# EAGLE schematic iRob_Upsized_F3DISCO_Shield v16 (EAGLE 9.7.0)
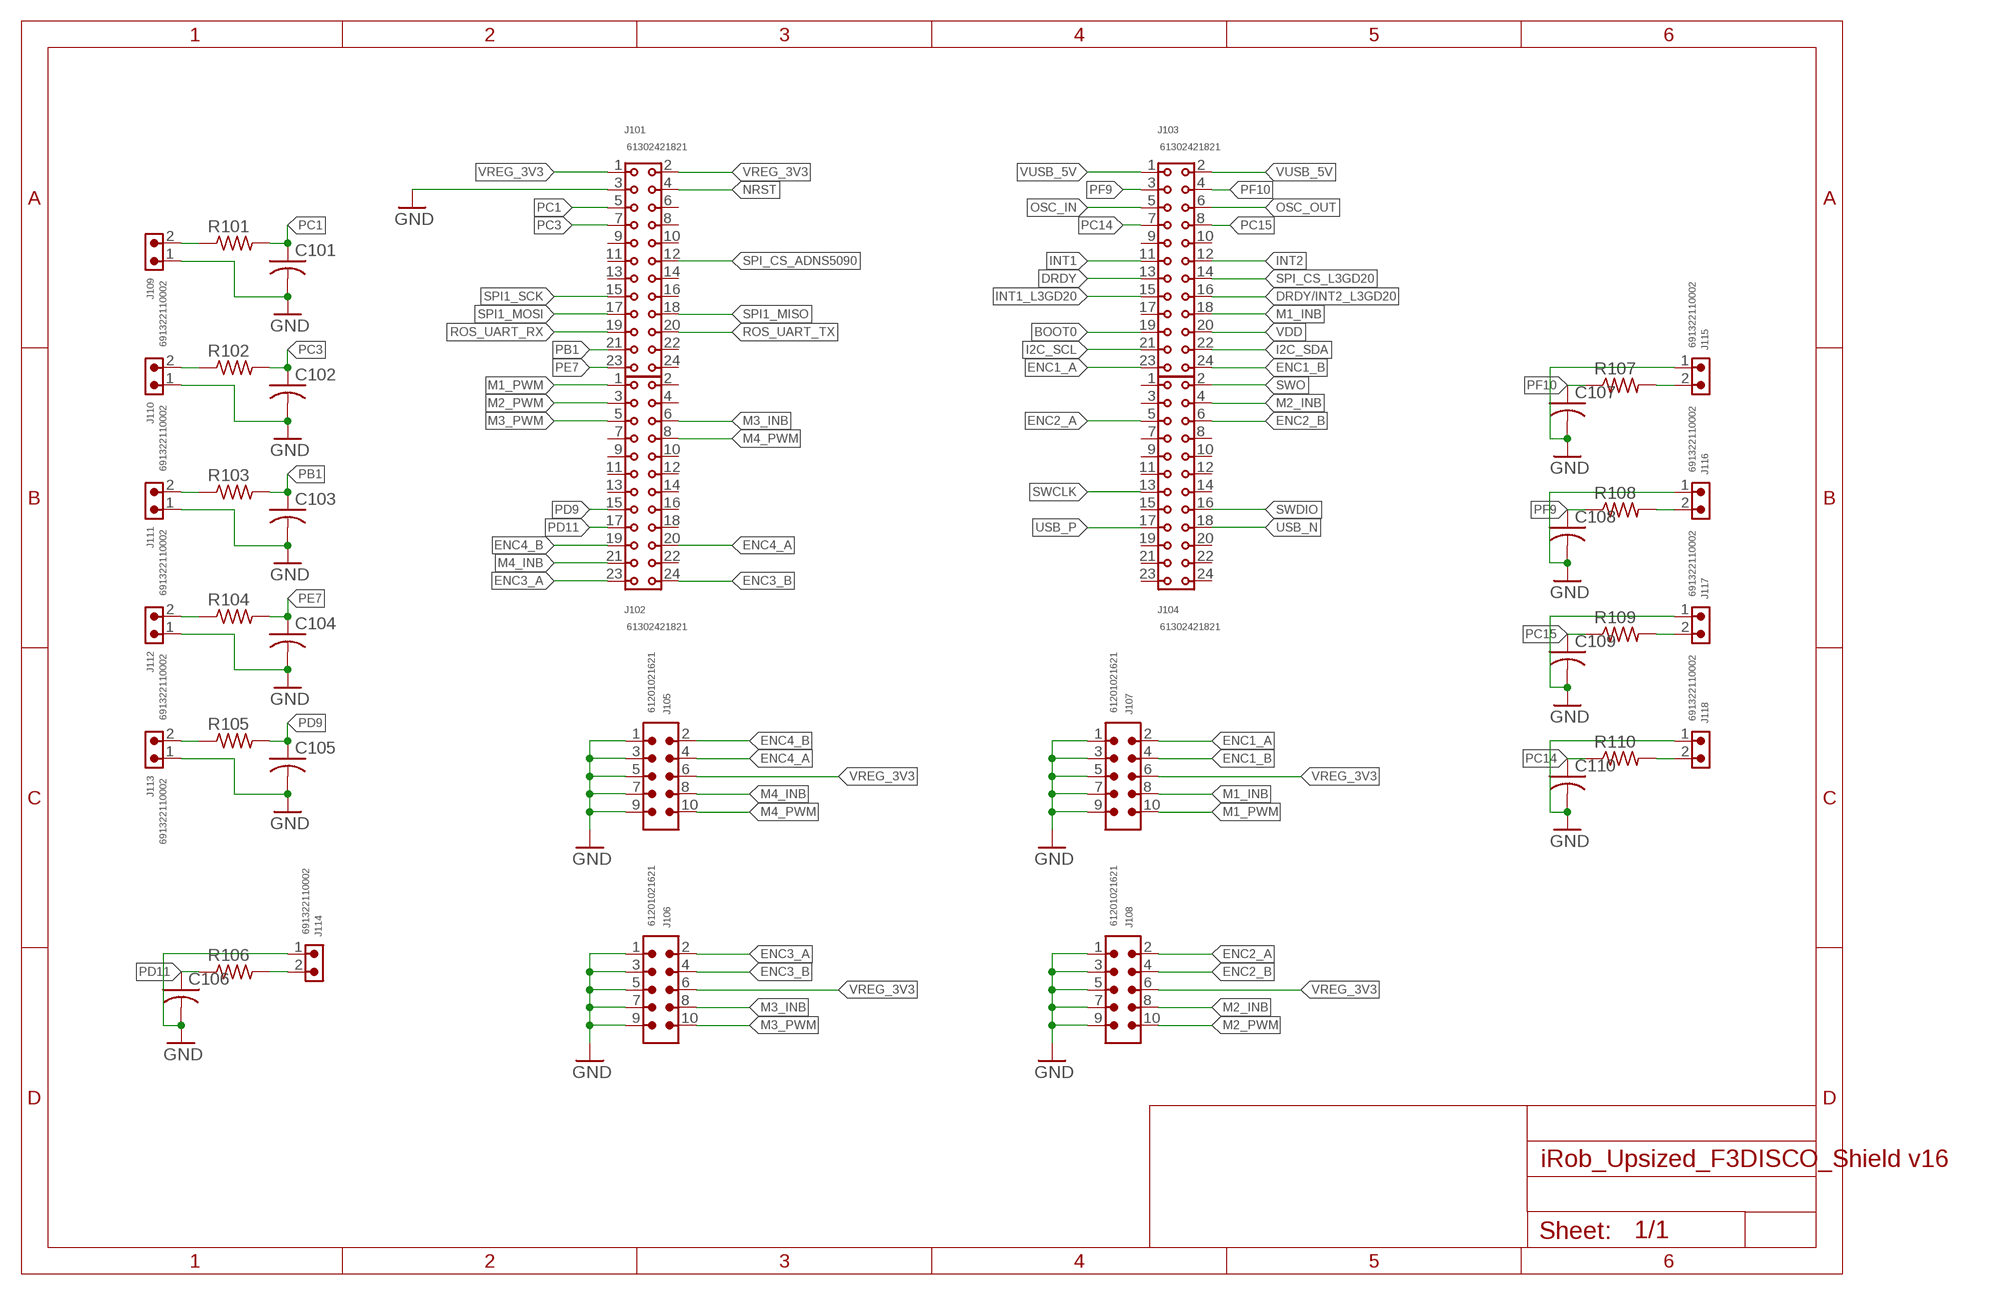
[diagram p0: schematic, sheet 1]

## Parts
C101  C-USC0603  [C0603]
C102  C-USC0603  [C0603]
C103  C-USC0603  [C0603]
C104  C-USC0603  [C0603]
C105  C-USC0603  [C0603]
C106  C-USC0603  [C0603]
C107  C-USC0603  [C0603]
C108  C-USC0603  [C0603]
C109  C-USC0603  [C0603]
C110  C-USC0603  [C0603]
J101  61302421821  6130XX21821_61302421821  [61302421821]
J102  61302421821  6130XX21821_61302421821  [61302421821]
J103  61302421821  6130XX21821_61302421821  [61302421821]
J104  61302421821  6130XX21821_61302421821  [61302421821]
J105  61201021621  6120XX21621_61201021621  [61201021621]
J106  61201021621  6120XX21621_61201021621  [61201021621]
J107  61201021621  6120XX21621_61201021621  [61201021621]
J108  61201021621  6120XX21621_61201021621  [61201021621]
J109  691322110002  691322110002  [691322110002]
J110  691322110002  691322110002  [691322110002]
J111  691322110002  691322110002  [691322110002]
J112  691322110002  691322110002  [691322110002]
J113  691322110002  691322110002  [691322110002]
J114  691322110002  691322110002  [691322110002]
J115  691322110002  691322110002  [691322110002]
J116  691322110002  691322110002  [691322110002]
J117  691322110002  691322110002  [691322110002]
J118  691322110002  691322110002  [691322110002]
R101  R-US_R0603  [R0603]
R102  R-US_R0603  [R0603]
R103  R-US_R0603  [R0603]
R104  R-US_R0603  [R0603]
R105  R-US_R0603  [R0603]
R106  R-US_R0603  [R0603]
R107  R-US_R0603  [R0603]
R108  R-US_R0603  [R0603]
R109  R-US_R0603  [R0603]
R110  R-US_R0603  [R0603]

## Nets
BOOT0: J103.19
DRDY: J103.13
DRDY/INT2_L3GD20: J103.16
ENC1_A: J103.23 J107.2
ENC1_B: J103.24 J107.4
ENC2_A: J104.5 J108.2
ENC2_B: J104.6 J108.4
ENC3_A: J102.23 J106.2
ENC3_B: J102.24 J106.4
ENC4_A: J102.20 J105.4
ENC4_B: J102.19 J105.2
GND: C101.2 C102.2 C103.2 C104.2 C105.2 C106.2 C107.2 C108.2 C109.2 C110.2 J101.3 J105.1 J105.3 J105.5 J105.7 J105.9 J106.1 J106.3 J106.5 J106.7 J106.9 J107.1 J107.3 J107.5 J107.7 J107.9 J108.1 J108.3 J108.5 J108.7 J108.9 J109.1 J110.1 J111.1 J112.1 J113.1 J114.1 J115.1 J116.1 J117.1 J118.1
I2C_SCL: J103.21
I2C_SDA: J103.22
INT1: J103.11
INT1_L3GD20: J103.15
INT2: J103.12
M1_INB: J103.18 J107.8
M1_PWM: J102.1 J107.10
M2_INB: J104.4 J108.8
M2_PWM: J102.3 J108.10
M3_INB: J102.6 J106.8
M3_PWM: J102.5 J106.10
M4_INB: J102.21 J105.8
M4_PWM: J102.8 J105.10
N$1: J109.2 R101.1
N$4: J110.2 R102.1
N$7: J111.2 R103.1
N$10: J112.2 R104.1
N$13: J113.2 R105.1
N$16: J114.2 R106.2
N$19: J115.2 R107.2
N$21: J116.2 R108.2
N$23: J117.2 R109.2
N$25: J118.2 R110.2
NRST: J101.4
OSC_IN: J103.5
OSC_OUT: J103.6
PB1: C103.1 J101.21 R103.2
PC1: C101.1 J101.5 R101.2
PC3: C102.1 J101.7 R102.2
PC14: C110.1 J103.7 R110.1
PC15: C109.1 J103.8 R109.1
PD9: C105.1 J102.15 R105.2
PD11: C106.1 J102.17 R106.1
PE7: C104.1 J101.23 R104.2
PF9: C108.1 J103.3 R108.1
PF10: C107.1 J103.4 R107.1
ROS_UART_RX: J101.19
ROS_UART_TX: J101.20
SPI1_MISO: J101.18
SPI1_MOSI: J101.17
SPI1_SCK: J101.15
SPI_CS_ADNS5090: J101.12
SPI_CS_L3GD20: J103.14
SWCLK: J104.13
SWDIO: J104.16
SWO: J104.2
USB_N: J104.18
USB_P: J104.17
VDD: J103.20
VREG_3V3: J101.1 J101.2 J105.6 J106.6 J107.6 J108.6
VUSB_5V: J103.1 J103.2
Unconnected: J101.6 J101.8 J101.9 J101.10 J101.11 J101.13 J101.14 J101.16 J101.22 J101.24 J102.2 J102.4 J102.7 J102.9 J102.10 J102.11 J102.12 J102.13 J102.14 J102.16 J102.18 J102.22 J103.9 J103.10 J103.17 J104.1 J104.3 J104.7 J104.8 J104.9 J104.10 J104.11 J104.12 J104.14 J104.15 J104.19 J104.20 J104.21 J104.22 J104.23 J104.24

## Library data of the parts
C101-C110 = adafruit:C-US: CAPACITOR, American symbol
J101-J104 = Wurth_Connectors_WR-PHD:6130XX21821_61302421821: WR-PHD 2.54 mm Dual Socket Header ARTICLE PROPERTIES: Pins:4;​ 6;​ 8;​ 10;​ 12;​ 14;​ 16;​ 18;​ 20;​ 22;​ 24;​ 26;​ 28;​ 30;​ 32;​ 34;​ 36;​ 40;​ 44;​ 64;​ 72 KIND PROPERTIES: Pitch：2.54 mm Quality Class:3 as per CECC 75 301-802 Rows：Dual Gender：Socket Header Type：Straight MATERIAL PROPERTIES: Insulator Material :PBT Insulator Flammability Rating:UL94 V-0 Contact Material:Copper Alloy Contact Plating:Gold Contact Type:Stamped GENERAL INFORMATION Operating Temperature:-40 up to +125 °C Compliance:Lead free / RoHS ELECTRICAL PROPERTIES: Rated Current:3 A IR 1:3 A Withstanding Voltage:500 V (AC) Contact Resistance:20 mΩ RISO:1000 MΩ CERTIFICATION UL Approval:E323964 PACKAGING PROPERTIES Packaging:Tray <https://katalog.we-online.com/media/images/v2/o57948v209%20Family_Dual_Socket_Header_WR-PHD_6130xx21821.jpg> Details see: https://katalog.we-online.com/en/em/PHD_2_54_DUAL_SOCKET_HEADER_6130XX21821 Updated by Yingchun,Shan 2019-10-21 2019 (C) Würth Elektronik; DATASHEET-URL: https://www.we-online.com/catalog/datasheet/61302421821.pdf; GENDER: Socket Header; IR: 3A; MOUNT: THT; PACKAGING: Tray; PART-NUMBER: 61302421821; PINS: 24; PITCH: 2.54mm; ROWS: Dual; TYPE: Straight
J105-J108 = Wurth_Connectors_WR-BHD:6120XX21621_61201021621: WR-BHD 2.54 mm Male Box Header KIND PROPERTIES: Pitch 2.54 mm Gender:Male MATERIAL PROPERTIES: Insulator Material:PBT Insulator Flammability Rating UL94 V-0 Insulator Color:Black Contact Material :Copper Alloy Contact Plating :Gold Contact Type: Stamped GENERAL INFORMATION: Operating Temperature:-40 °C up to +125 °C Compliance:RoHS Working Voltage: 250 V (AC) Withstanding Voltage:500 V (AC) Contact Resistance: 20 mΩ Insulation Resistance:1000 MΩ CERTIFICATION: UL Approval:E323964 PACKAGING PROPERTIES Packaging :Tray <https://www.we-online.com/catalog/media/o32884v209%20Family_WR-BHD_6120xx21621.jpg> Details see: https://www.we-online.com/catalog/en/BHD_2_54_MALE_BOX_HEADER_6120XX21621 Updated by Ella Wu 2021-3-12 2021 (C) Würth Elektronik; CONTACT-RESISTANCE: 20mOhm; DATASHEET-URL: https://www.we-online.com/catalog/datasheet/61201021621.pdf; GENDER: Male; IR: 3A; LENGTH: 20.36mm; MOUNT: THT; PACKAGING: Tray; PART-NUMBER: 61201021621; PINS: 10; PITCH: 2.54mm; TYPE: Straight; WORKING-VOLTAGE: 250V(AC)
J109-J118 = Wurth_Connectors_WR-TBL Pluggable Connector:691322110002: WR-TBL Serie 3221 - 3.50 mm Horizontal PCB Header KIND PROPERTIES Pitch 3.5 mm MATERIAL PROPERTIES Insulator Material PA66 Insulator Flammability Rating UL94 V-0 Contact Material Brass Contact Plating Tin GENERAL INFORMATION Operating Temperature -40 up to +105 °C Compliance RoHS ELECTRICAL PROPERTIES IR cULus 10 A IR VDE 10.5 A Working Voltage [cULus] 300 V (AC) Working Voltage [VDE] 300 V (AC) Withstanding Voltage [cULus] 1600 V (AC) Withstanding Voltage [VDE] 2500 V (AC) Contact Resistance [cULus] 20 mΩ Contact Resistance [VDE] 20 mΩ CERTIFICATION cULus Approval E315414 VDE Approval 40023195 <https://www.we-online.com/catalog/media/o33276v209%20Family_WR-TBL_69132211000x.jpg> Details see: https://www.we-online.com/catalog/en/TBL_3_50_3221_HORIZONTAL_PCB_HEADER_69132211000X/ Updated by Ella Wu 2019-12-18 2019(C) Wurth Elektronik; DATASHEET-URL: https://www.we-online.com/catalog/datasheet/691322110002.pdf; IR-UL: 10A; IR-VDE: 10.5A; MOUNT: THT; PART-NUMBER: 691322110002; PINS: 2; PITCH: 3.5mm; TYPE: Horizontal; WORKING-VOLTAGE-UL: 300V (AC); WORKING-VOLTAGE-VDE: 300V (AC)
R101-R110 = adafruit:R-US_: RESISTOR, American symbol